# Altium project ERN_MainPowerV2.PrjPcb
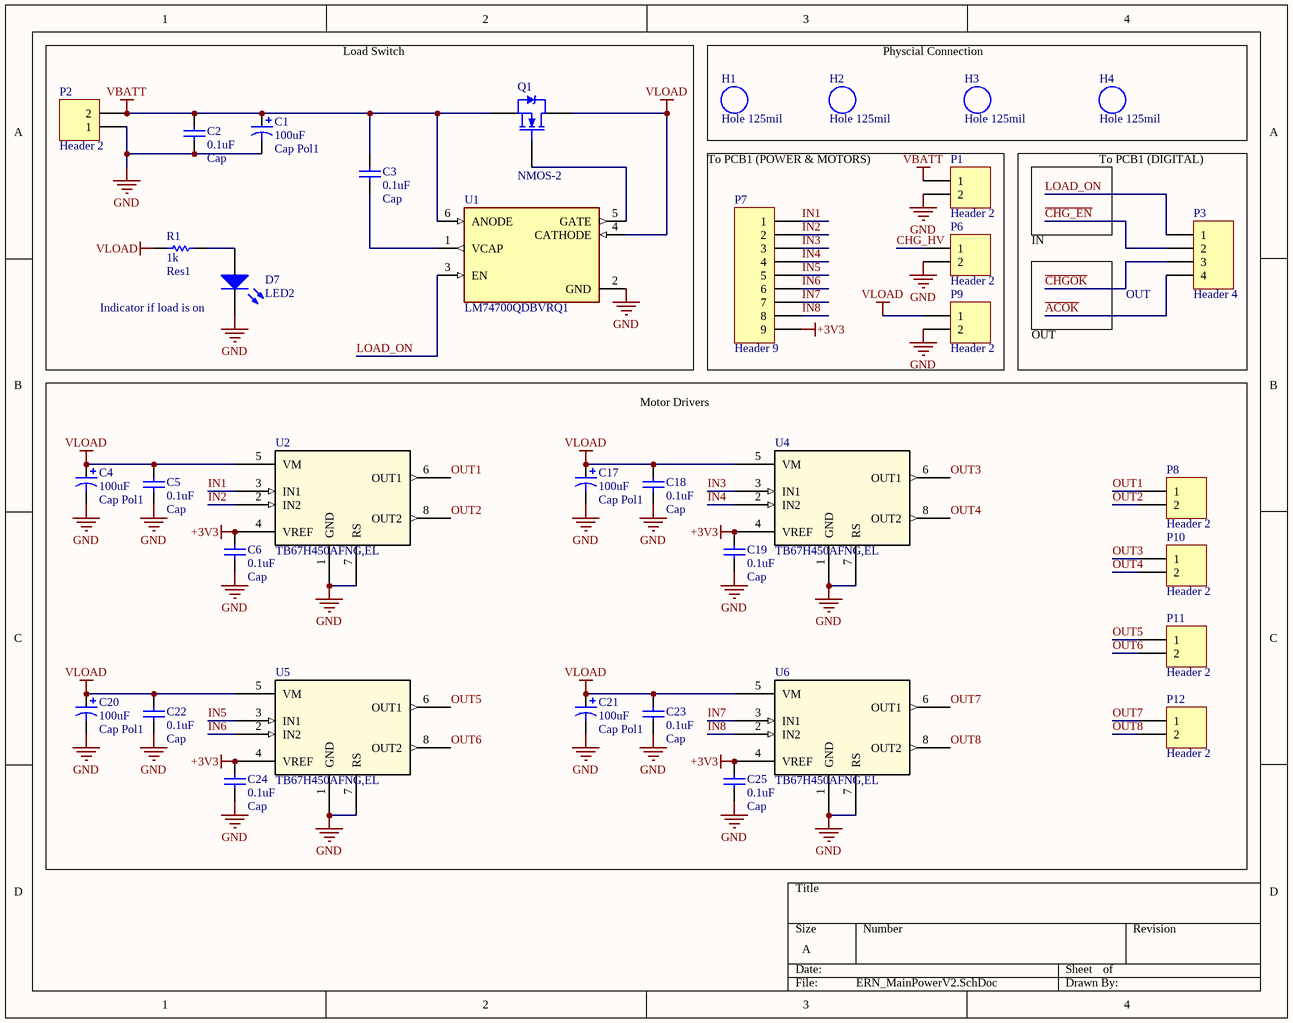
[diagram p0: ERN_MainPowerV2.SchDoc]
2 sheets, 68 parts. Net scope: global (net labels, ports and power ports of the same name join across sheets).
Board file: ERN_MainPowerV2.PcbDoc
Sheets:
  ERN_MainPowerV2.SchDoc
  ERN_MainPowerV2_2.SchDoc

## Sheet ERN_MainPowerV2.SchDoc
size A; SheetNumber: 1; SheetTotal: 2; SPICEModelCacheJSZPDIHS: <root> / <DocumentId>JSZPDIHS</DocumentId> / <CacheFrame Number="0"> / <Model Name="irf1010" Kind="CKT"> / <Text>*IRF1010 MCE 4-2-96 / *55V  75A .014 ohm HEXFET pkg:TO-220 2,1,3 / .SUBCKT IRF1010  10 20 40 40 / M1   1  2  3  3  DMOS L=1U W=1U / RD  10  1  5.65M / RS  30  3  1.35M / RG  20  2  12.1 / CGS  2  3  2.15N / EGD 12  0  2  1  1 / VFB 14  0  0 / FFB  2  1  VFB  1 / CGD 13 14  4.49N / R1  13  0  1 / D1  12 13  DLIM / DDG 15 14  DCGD / R2  12 15  1 / D2  15  0  DLIM / DSD  3 10  DSUB / LS  30 40  7.5N / .MODEL DMOS NMOS (LEVEL=3 THETA=60M VMAX=114K ETA=2M VTO=3 KP=19.4) / .MODEL DCGD D (CJO=4.49N VJ=.6 M=.68) / .MODEL DSUB D (IS=311N N=1.5 RS=8.67M BV=55 CJO=4.08N VJ=.8 M=.42 TT=100N) / .MODEL DLIM D (IS=100U) / .ENDS IRF1010</Text> / </Model> / <Model Name="led2" Kind="MDL"> / <Text>*Typ RED,GREEN,YELLOW,AMBER GaAs LED: Vf=2.1V Vr=4V If=40mA trr=3uS / *LED Pinout: 1=A, 2=K / .MODEL LED2 D (IS=93.1P RS=42M N=4.61 BV=4 IBV=10U / + CJO=2.97P VJ=.75 M=.333 TT=4.32U)</Text> / </Model> / </CacheFrame> / </root>

### Parts
C1  Cap Pol1  value 100uF  [Cap_47uF_100uF]
C2  Cap  value 0.1uF  [RAD-0.3]
C3  Cap  value 0.1uF  [C0805]
C4  Cap Pol1  value 100uF  [Cap_47uF_100uF]
C5  Cap  value 0.1uF  [C0805]
C6  Cap  value 0.1uF  [RAD-0.3]
C17  Cap Pol1  value 100uF  [Cap_47uF_100uF]
C18  Cap  value 0.1uF  [C0805]
C19  Cap  value 0.1uF  [RAD-0.3]
C20  Cap Pol1  value 100uF  [Cap_47uF_100uF]
C21  Cap Pol1  value 100uF  [Cap_47uF_100uF]
C22  Cap  value 0.1uF  [C0805]
C23  Cap  value 0.1uF  [C0805]
C24  Cap  value 0.1uF  [RAD-0.3]
C25  Cap  value 0.1uF  [RAD-0.3]
D7  LED2  [led-0]
H1  Hole 125mil  [Hole 125mil]
H2  Hole 125mil  [Hole 125mil]
H3  Hole 125mil  [Hole 125mil]
H4  Hole 125mil  [Hole 125mil]
P1  Header 2  [HDR1X2]
P2  Header 2  [HDR1X2]
P3  Header 4  [HDR1X4]
P6  Header 2  [HDR1X2]
P7  Header 9  [HDR1X9]
P8  Header 2  [HDR1X2]
P9  Header 2  [HDR1X2]
P10  Header 2  [HDR1X2]
P11  Header 2  [HDR1X2]
P12  Header 2  [HDR1X2]
Q1  NMOS-2  [TO-220AB]
R1  Res1  value 1k  [AXIAL-0.3]
U1  LM74700QDBVRQ1  [SOT95P280X145-6N]
U2  TB67H450AFNG,EL  [P-HSOP8-0405-1.27-002_TOS]
U4  TB67H450AFNG,EL  [P-HSOP8-0405-1.27-002_TOS]
U5  TB67H450AFNG,EL  [P-HSOP8-0405-1.27-002_TOS]
U6  TB67H450AFNG,EL  [P-HSOP8-0405-1.27-002_TOS]

### Blocks framed on the sheet
Physcial Connection: H1-H4
To PCB1 (POWER & MOTORS): P1 P6 P7 P9
Motor Drivers: C4-C6 C17-C25 P8 P10-P12 U2 U4-U6

### Nets
+3V3: C6.2 C19.2 C24.2 C25.2 P7.9 U2.4(VREF) U4.4(VREF) U5.4(VREF) U6.4(VREF)
GND: C1.2 C2.1 C4.2 C5.1 C6.1 C17.2 C18.1 C19.1 C20.2 C21.2 C22.1 C23.1 C24.1 C25.1 D7.2(K) P1.2 P2.1 P6.2 P9.2 U1.2(GND) U2.1(GND) U2.7(RS) U4.1(GND) U4.7(RS) U5.1(GND) U5.7(RS) U6.1(GND) U6.7(RS)
VBATT: C1.1 C2.2 C3.2 P1.1 P2.2 Q1.3(S) U1.6(ANODE)
VLOAD: C4.1 C5.2 C17.1 C18.2 C20.1 C21.1 C22.2 C23.2 P9.1 Q1.2(D) R1.1 U1.4(CATHODE) U2.5(VM) U4.5(VM) U5.5(VM) U6.5(VM)
~{ACOK}: P3.4
~{CHG_EN}: P3.2
~{CHGOK}: P3.3
CHG_HV: P6.1
IN1: P7.1 U2.3(IN1)
IN2: P7.2 U2.2(IN2)
IN3: P7.3 U4.3(IN1)
IN4: P7.4 U4.2(IN2)
IN5: P7.5 U5.3(IN1)
IN6: P7.6 U5.2(IN2)
IN7: P7.7 U6.3(IN1)
IN8: P7.8 U6.2(IN2)
LOAD_ON: P3.1 U1.3(EN)
OUT1: P8.1 U2.6(OUT1)
OUT2: P8.2 U2.8(OUT2)
OUT3: P10.1 U4.6(OUT1)
OUT4: P10.2 U4.8(OUT2)
OUT5: P11.1 U5.6(OUT1)
OUT6: P11.2 U5.8(OUT2)
OUT7: P12.1 U6.6(OUT1)
OUT8: P12.2 U6.8(OUT2)
NetC3_1: C3.1 U1.1(VCAP)
NetD7_1: D7.1(A) R1.2
NetQ1_1: Q1.1(G) U1.5(GATE)

### Notes on the sheet
- Load Switch
- To PCB1 (DIGITAL)
- IN
- (near P3) OUT
- (near D7) Indicator if load is on
- OUT

### Library data of the parts
C1 C4 C17 C20 C21 = Cap Pol1: Polarized Capacitor (Radial); Published: 8-Jun-2000; LatestRevisionDate: 17-Jul-2002; LatestRevisionNote: Re-released for DXP Platform.; PackageReference: RB7.6-15; Publisher: Altium Limited; PackageDescription: Polarized Capacitor (Radial); 2 Leads
C2 C3 C5 C6 C18 C19 C22-C25 = Cap: Capacitor; Published: 8-Jun-2000; LatestRevisionDate: 17-Jul-2002; LatestRevisionNote: Re-released for DXP Platform.; PackageReference: RAD-0.3; Publisher: Altium Limited; PackageDescription: Radial Cap, Thru-Hole; 2 Leads; 0.3 in Pin Spacing
D7 = LED2: Typical RED, GREEN, YELLOW, AMBER GaAs LED; Published: 8-Jun-2000; LatestRevisionDate: 17-Jul-2002; LatestRevisionNote: Re-released for DXP Platform.; PackageVersion: Feb-2002; PackageReference: 3.2X1.6X1.1; Publisher: Altium Limited; PackageDescription: SM LED; 2 Flat Leads
P1 P2 P6 P8-P12 = Header 2: Header, 2-Pin; LatestRevisionDate: 17-Jul-2002; LatestRevisionNote: Re-released for DXP Platform.; Publisher: Altium Limited
P3 = Header 4: Header, 4-Pin; LatestRevisionDate: 17-Jul-2002; LatestRevisionNote: Re-released for DXP Platform.; Publisher: Altium Limited
P7 = Header 9: Header, 9-Pin; LatestRevisionDate: 17-Jul-2002; LatestRevisionNote: Re-released for DXP Platform.; Publisher: Altium Limited
Q1 = NMOS-2: N-Channel Power MOSFET; Note: Pin 2 is electrically connected to pin 4.; Published: 8-Jun-2000; LatestRevisionDate: 17-Jul-2002; LatestRevisionNote: Re-released for DXP Platform.; DatasheetVersion: PD-9.814; PackageVersion: Feb-1997; PackageReference: TO-220AB; Publisher: Altium Limited; PackageDescription: TO, Thru-Hole, Vertical, Heatsink Mounted; 3 In-Line Leads; Pitch 2.54 mm; ComponentLink1Description: Manufacturer Link; ComponentLink1URL: http://www.irf.com/
R1 = Res1: Resistor; Published: 8-Jun-2000; LatestRevisionDate: 17-Jul-2002; LatestRevisionNote: Re-released for DXP Platform.; PackageReference: AXIAL-0.3; Publisher: Altium Limited; PackageDescription: Axial Device, Thru-Hole; 2 Leads; 0.3 in Pin Spacing
U1 = LM74700QDBVRQ1: 3.2-V to 65-V, 80-uA IQ automotive ideal diode controller; MF: Texas Instruments; SnapEDA_Link: https://www.snapeda.com/parts/LM74700QDBVRQ1/Texas+Instruments/view-part/?ref=snap; Package: SOT-23-6 Texas Instruments; Value: *; MP: LM74700QDBVRQ1; Check_prices: https://www.snapeda.com/parts/LM74700QDBVRQ1/Texas+Instruments/view-part/?ref=eda
U2 U4-U6 = TB67H450AFNG,EL: Toshiba Motor Driver IC; Manufacturer_Name: Toshiba Electronic Devices & Storage Corp.; Copyright: Copyright (C) 2025 Ultra Librarian. All rights reserved.; Manufacturer_Part_Number: TB67H450AFNG,EL; RefDes: RefDes; Type: Type

## Sheet ERN_MainPowerV2_2.SchDoc
size A; SheetNumber: 2; SheetTotal: 2; SPICEModelCacheXTMDSSOX: <root> / <DocumentId>XTMDSSOX</DocumentId> / <CacheFrame Number="0"> / <Model Name="led2" Kind="MDL"> / <Text>*Typ RED,GREEN,YELLOW,AMBER GaAs LED: Vf=2.1V Vr=4V If=40mA trr=3uS / *LED Pinout: 1=A, 2=K / .MODEL LED2 D (IS=93.1P RS=42M N=4.61 BV=4 IBV=10U / + CJO=2.97P VJ=.75 M=.333 TT=4.32U)</Text> / </Model> / <Model Name="1n5406" Kind="MDL"> / <Text>*1N5406 MCE / *600V 3A Si Rectifier pkg:DO-201 1,2 / .MODEL 1N5406 D(IS=2.68E-12 RS=0.00731 N=1.17 TT=1.44E-5 CJO=1.24E-10 / + VJ=0.6 M=0.333 BV=900 IBV=1E-5 )</Text> / </Model> / </CacheFrame> / </root>
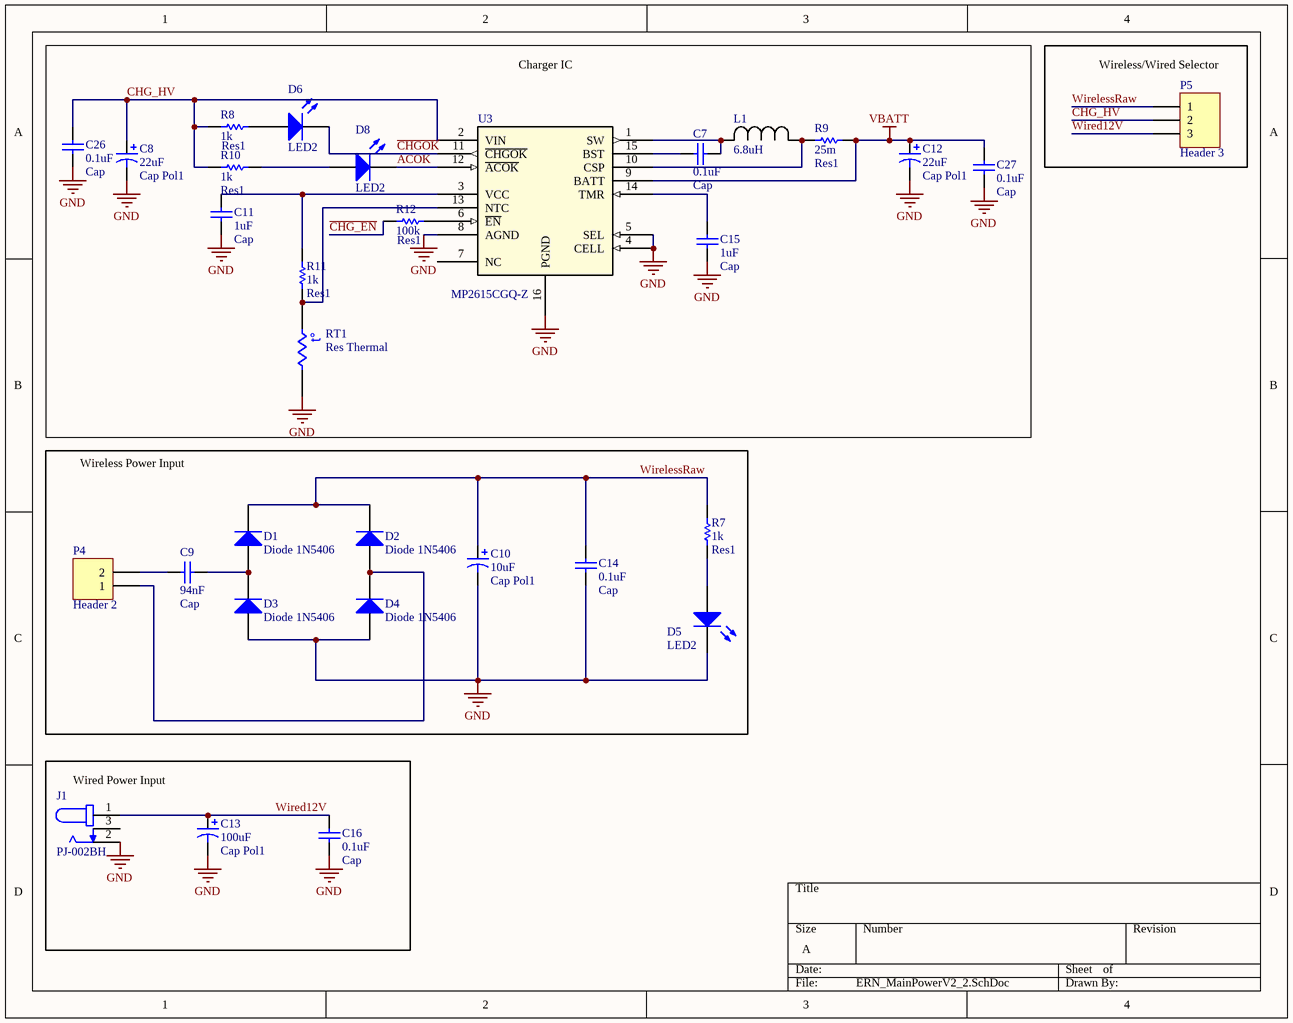
[diagram p1: ERN_MainPowerV2_2.SchDoc]

### Parts
C7  Cap  value 0.1uF  [C0805]
C8  Cap Pol1  value 22uF  [Cap_47uF_100uF]
C9  Cap  value 94nF  [C1210]
C10  Cap Pol1  value 10uF  [Cap_47uF_100uF]
C11  Cap  value 1uF  [C0805]
C12  Cap Pol1  value 22uF  [Cap_47uF_100uF]
C13  Cap Pol1  value 100uF  [Cap_47uF_100uF]
C14  Cap  value 0.1uF  [RAD-0.3]
C15  Cap  value 1uF  [C0805]
C16  Cap  value 0.1uF  [RAD-0.3]
C26  Cap  value 0.1uF  [C0805]
C27  Cap  value 0.1uF  [rad-0.3]
D1  Diode 1N5406  [DO-201AD]
D2  Diode 1N5406  [DO-201AD]
D3  Diode 1N5406  [DO-201AD]
D4  Diode 1N5406  [DO-201AD]
D5  LED2  [led-0]
D6  LED2  [led-0]
D8  LED2  [led-0]
J1  PJ-002BH  [CUI_PJ-002BH]
L1  6.8uH  [IND_VLS6045EX-6R8M]
P4  Header 2  [HDR1X2]
P5  Header 3  [HDR1X3]
R7  Res1  value 1k  [AXIAL-0.3]
R8  Res1  value 1k  [AXIAL-0.3]
R9  Res1  value 25m  [RESC6432X90N]
R10  Res1  value 1k  [AXIAL-0.3]
R11  Res1  value 1k  [AXIAL-0.3]
R12  Res1  value 100k  [AXIAL-0.3]
RT1  Res Thermal  [AXIAL-0.3]
U3  MP2615CGQ-Z  [QFN-16_3MM×3MM_MNP_MPS]

### Blocks framed on the sheet
Charger IC: C7 C8 C11 C12 C15 C26 C27 D6 D8 L1 R8-R12 RT1 U3
Wireless/Wired Selector: P5
Wireless Power Input: C9 C10 C14 D1-D5 P4 R7
Wired Power Input: C13 C16 J1

### Nets
GND: C8.2 C10.2 C11.1 C12.2 C13.2 C14.2 C15.2 C16.2 C26.1 C27.2 D3.1(A) D4.1(A) D5.2(K) J1.2 RT1.2 U3.4(CELL) U3.5(SEL) U3.8(AGND) U3.16(PGND)
VBATT: C12.1 C27.1 R9.2 U3.9(BATT)
~{ACOK}: D8.2(K) U3.12(~{ACOK})
~{CHG_EN}: R12.2
~{CHGOK}: D6.2(K) U3.11(~{CHGOK})
CHG_HV: C8.1 C26.2 P5.2 R8.2 R10.2 U3.2(VIN)
Wired12V: C13.1 C16.1 J1.1 P5.3
WirelessRaw: C10.1 C14.1 D1.2(K) D2.2(K) P5.1 R7.2
NetC7_1: C7.1 U3.15(BST)
NetC7_2: C7.2 L1.2 U3.1(SW)
NetC9_1: C9.1 P4.2
NetC9_2: C9.2 D1.1(A) D3.2(K)
NetC11_2: C11.2 R11.1 U3.3(VCC)
NetC15_1: C15.1 U3.14(TMR)
NetD2_1: D2.1(A) D4.2(K) P4.1
NetD5_1: D5.1(A) R7.1
NetD6_1: D6.1(A) R8.1
NetD8_1: D8.1(A) R10.1
NetL1_1: L1.1 R9.1 U3.10(CSP)
NetR11_2: R11.2 RT1.1 U3.13(NTC)
NetR12_1: R12.1 U3.6(~{EN})

Not connected (* = marked no-connect by the designer): J1 3; U3 7(NC)

### Notes on the sheet
- (in symbol Res Thermal) t°

### Library data of the parts
C7 C9 C11 C14-C16 C26 C27 = Cap: Capacitor; Published: 8-Jun-2000; LatestRevisionDate: 17-Jul-2002; LatestRevisionNote: Re-released for DXP Platform.; PackageReference: RAD-0.3; Publisher: Altium Limited; PackageDescription: Radial Cap, Thru-Hole; 2 Leads; 0.3 in Pin Spacing
C8 C10 C12 C13 = Cap Pol1: Polarized Capacitor (Radial); Published: 8-Jun-2000; LatestRevisionDate: 17-Jul-2002; LatestRevisionNote: Re-released for DXP Platform.; PackageReference: RB7.6-15; Publisher: Altium Limited; PackageDescription: Polarized Capacitor (Radial); 2 Leads
D1-D4 = Diode 1N5406: 3 Amp General Purpose Rectifier; Published: 8-Jun-2000; LatestRevisionDate: 17-Jul-2002; LatestRevisionNote: Re-released for DXP Platform.; DatasheetVersion: 1998; PackageVersion: Aug-1999; PackageReference: DO-201AD; Publisher: Altium Limited; PackageDescription: Diode, Axial; Body 9.5 x 5.6 mm (LxDia. max), Lead Dia. 1.32 mm (max); ComponentLink1Description: Manufacturer Link; ComponentLink1URL: http://www.fairchildsemi.com/; ComponentLink2Description: Datasheet; ComponentLink2URL: http://www.fairchildsemi.com/ds/1N%2F1N5400.pdf
D5 D6 D8 = LED2: as D7 on sheet ERN_MainPowerV2; Published: 8-Jun-2000; LatestRevisionDate: 17-Jul-2002; LatestRevisionNote: Re-released for DXP Platform.; PackageVersion: Feb-2002; PackageReference: 3.2X1.6X1.1; Publisher: Altium Limited; PackageDescription: SM LED; 2 Flat Leads
J1 = PJ-002BH: 2.5 x 6.5 mm, 5.0 A, Horizontal, Through Hole, Dc Power Jack Connector; MF: Same Sky; SnapEDA_Link: https://www.snapeda.com/parts/PJ-002BH/Same+Sky/view-part/?ref=snap; Package: None; Value: *; MP: PJ-002BH; Check_prices: https://www.snapeda.com/parts/PJ-002BH/Same+Sky/view-part/?ref=eda
L1 = 2111-V-RC: Inductor 68uH; Manufacturer_Name: Bourns Electronics; Copyright: Copyright (C) 2026 Ultra Librarian. All rights reserved.; Manufacturer_Part_Number: 2111-V-RC
P4 = Header 2: Header, 2-Pin; LatestRevisionDate: 17-Jul-2002; LatestRevisionNote: Re-released for DXP Platform.; Publisher: Altium Limited
P5 = Header 3: Header, 3-Pin; LatestRevisionDate: 17-Jul-2002; LatestRevisionNote: Re-released for DXP Platform.; Publisher: Altium Limited
R7-R12 = Res1: Resistor; Published: 8-Jun-2000; LatestRevisionDate: 17-Jul-2002; LatestRevisionNote: Re-released for DXP Platform.; PackageReference: AXIAL-0.3; Publisher: Altium Limited; PackageDescription: Axial Device, Thru-Hole; 2 Leads; 0.3 in Pin Spacing
RT1 = Res Thermal: Thermistor; Published: 24-Mar-1999; LatestRevisionDate: 29-May-2009; LatestRevisionNote: IPC-7351 Footprint Added.; PackageVersion: Mar-2003; PackageReference: 6-0805; Publisher: Altium Limited; PackageDescription: Chip Resistor 0805 Case Size; Code_IPC: RESC2012
U3 = MP2615CGQ-Z: 2.1A 1- or 2-Cell Li-ion Battery Charger with 25mohm Rsns; Manufacturer_Name: Monolithic Power Systems; Copyright: Copyright (C) 2026 Ultra Librarian. All rights reserved.; Manufacturer_Part_Number: MP2615CGQ-Z; RefDes: RefDes; Type: Type

## Nets that join several sheets
GND: ERN_MainPowerV2 (28 pins), ERN_MainPowerV2_2 (19 pins)
VBATT: ERN_MainPowerV2 (7 pins), ERN_MainPowerV2_2 (C12.1 C27.1 R9.2 U3.9)
~{ACOK}: ERN_MainPowerV2 (P3.4), ERN_MainPowerV2_2 (D8.2 U3.12)
~{CHG_EN}: ERN_MainPowerV2 (P3.2), ERN_MainPowerV2_2 (R12.2)
~{CHGOK}: ERN_MainPowerV2 (P3.3), ERN_MainPowerV2_2 (D6.2 U3.11)
CHG_HV: ERN_MainPowerV2 (P6.1), ERN_MainPowerV2_2 (6 pins)